# Altium schematic sheet Э2.SchDoc
size 594 x 420 mm; Address1: Address1; Address2: Address2; Address3: Address3; Address4: Address4; SheetNumber: 1; SheetTotal: 7; DocumentType: Схема электрическая принципиальная
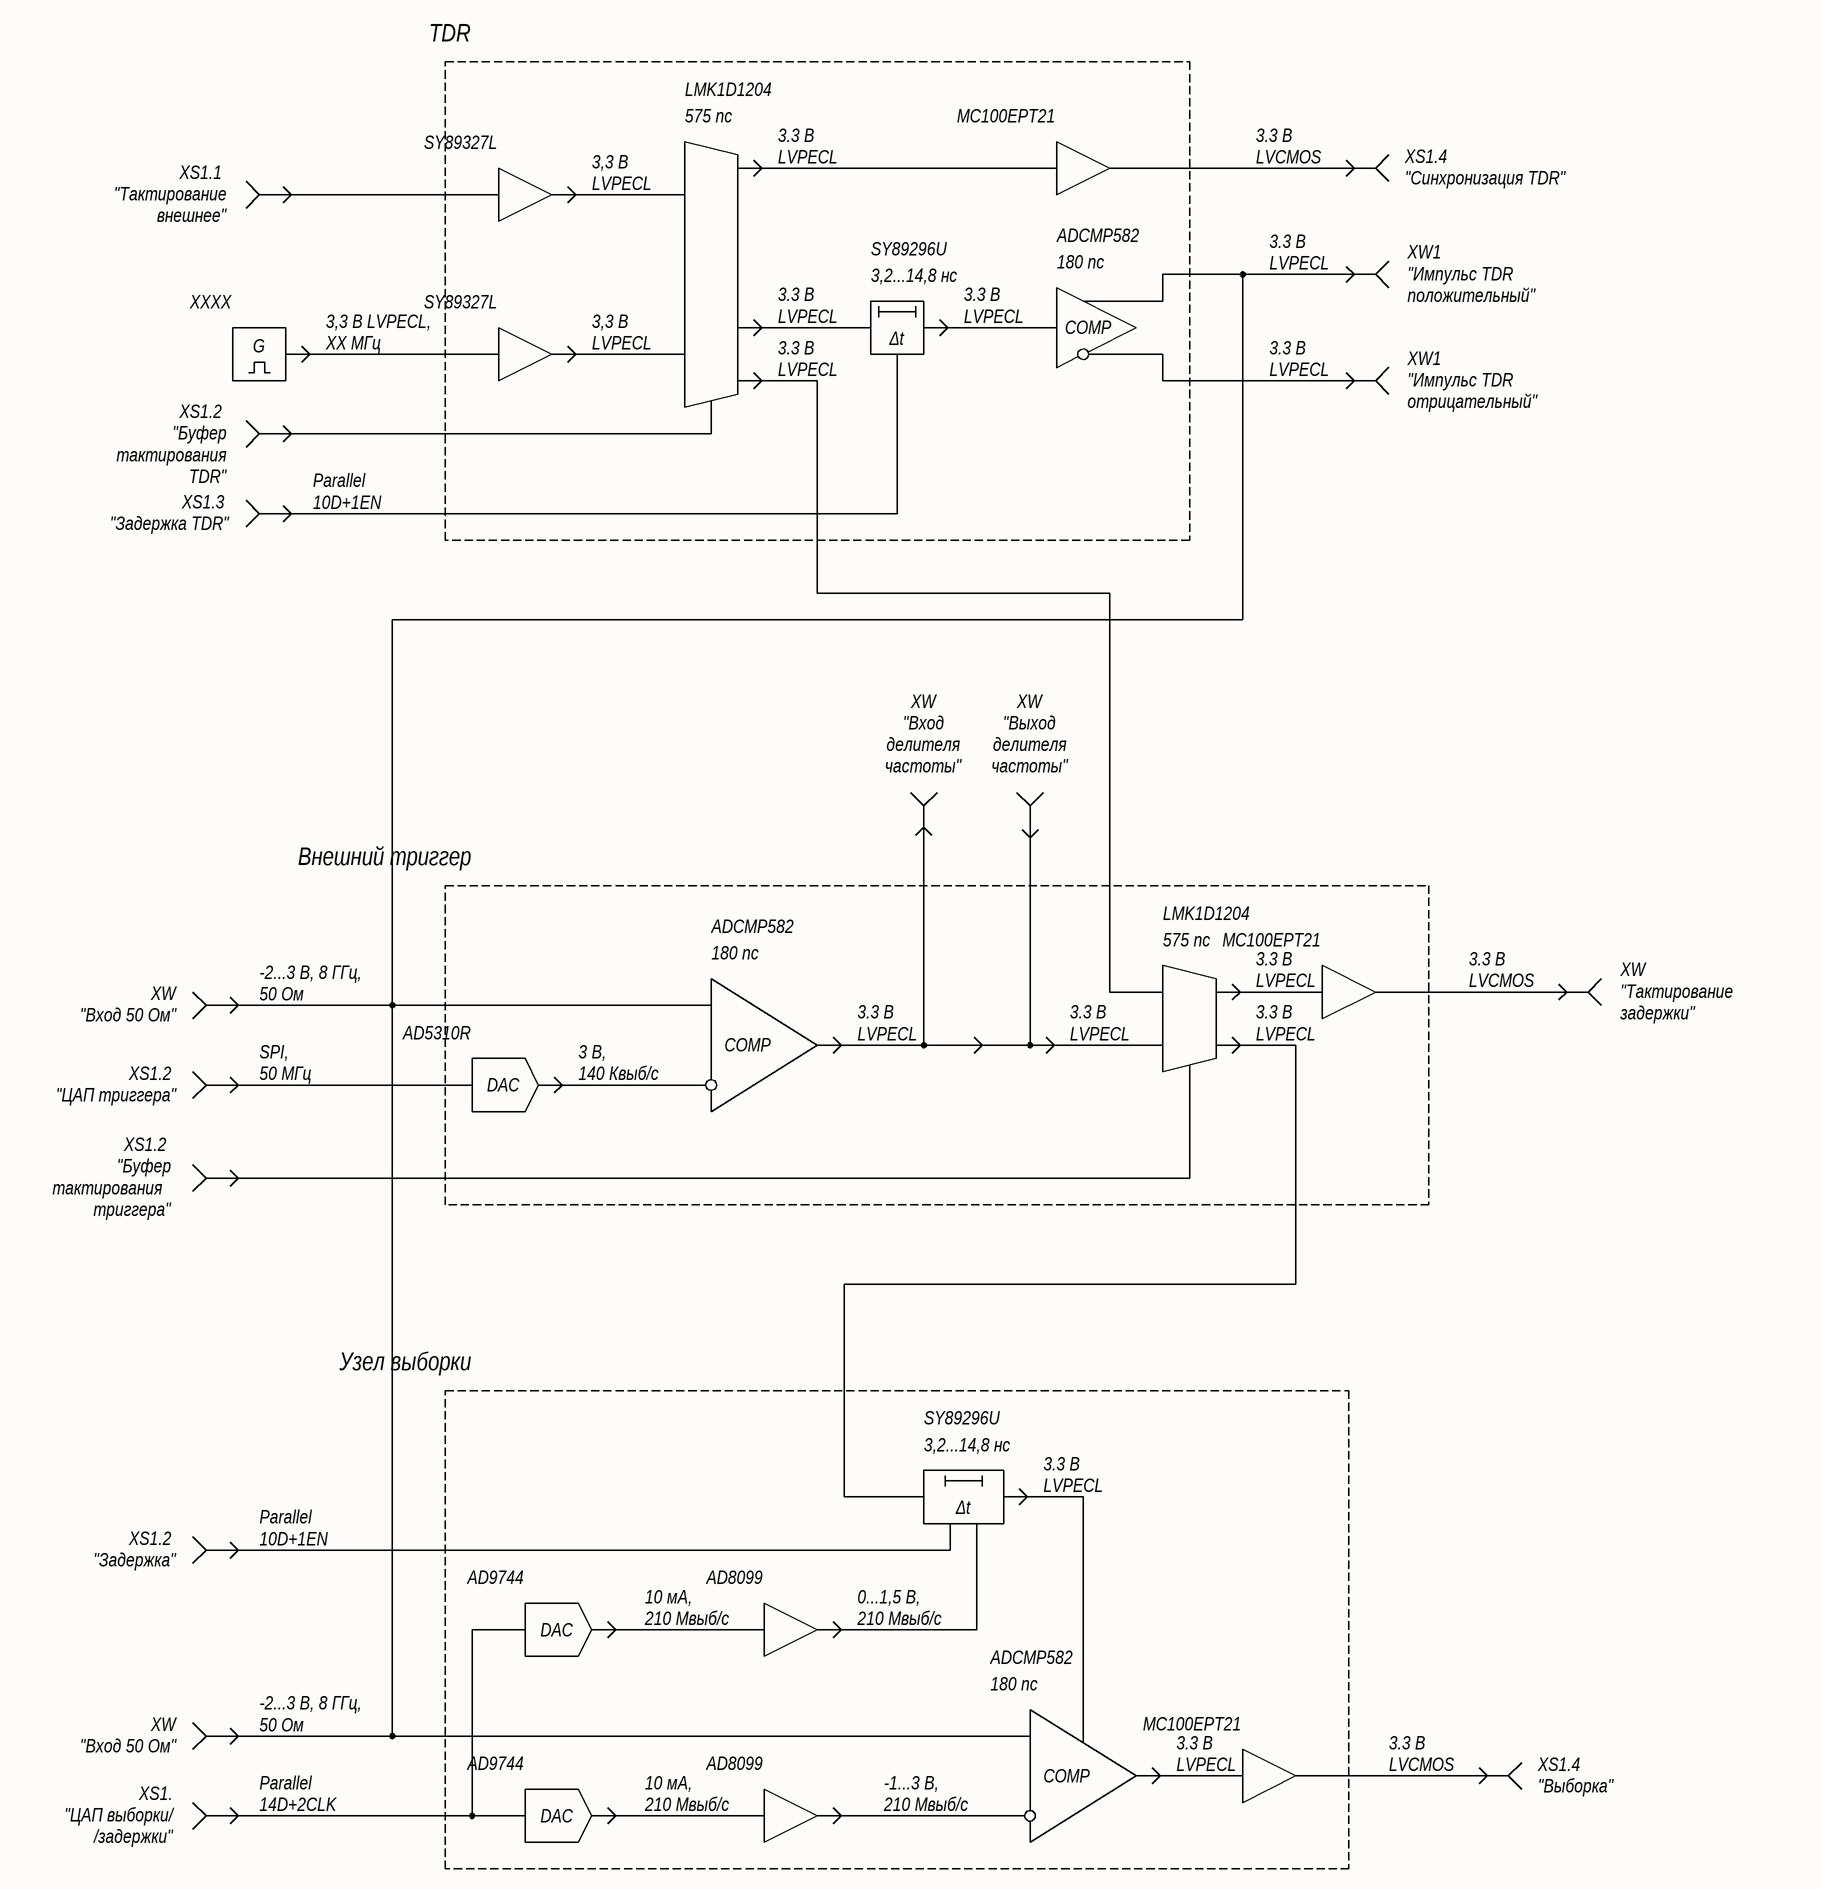
[diagram p0: Э2.SchDoc]

## Notes on the sheet
- TDR
- LMK1D1204
- SY89327L
- 575 пс
- 3.3 В
  LVPECL
- MC100EPT21
- 3.3 В
  LVCMOS
- XS1.1
  "Тактирование
  внешнее"
- 3,3 В
  LVPECL
- ADCMP582
- XS1.4
  "Синхронизация TDR"
- XXXX
- 3,2...14,8 нс
- SY89296U
- 180 пс
- XW1
  "Импульс TDR
  положительный"
- G
- 3,3 В LVPECL,
  XX МГц
- Δt
- COMP
- XW1
  "Импульс TDR
  отрицательный"
- XS1.2
  "Буфер
  тактирования TDR"
- Parallel
  10D+1EN
- XS1.3
  "Задержка TDR"
- XW
  "Вход
  делителя
  частоты"
- XW
  "Выход
  делителя
  частоты"
- Внешний триггер
- XW
  "Вход 50 Ом"
- -2...3 В, 8 ГГц,
  50 Ом
- AD5310R
- XW
  "Тактирование
  задержки"
- XS1.2
  "ЦАП триггера"
- SPI,
  50 МГц
- DAC
- 3 В,
  140 Квыб/с
- XS1.2
  "Буфер
  тактирования
  триггера"
- Узел выборки
- XS1.2
  "Задержка"
- AD9744
- AD8099
- 10 мА,
  210 Мвыб/с
- 0...1,5 В,
  210 Мвыб/с
- XS1.4
  "Выборка"
- XS1.
  "ЦАП выборки/
  /задержки"
- Parallel
  14D+2CLK
- -1...3 В,
  210 Мвыб/с
- Перв. примен.
- Справ. №
- Подп. и дата
- Инв. № дубл.
- Взам. инв. №
- Разраб.
- Изм.
- Лист
- № докум.
- Подп.
- Дата
- Лит.
- Масса
- Масштаб
- Пров.
- Т.контр.
- Листов
- Инв. № подл.
- Утв.
- Н.контр.
- 2.106-A2
- Копировал
- Формат А2